# Altium schematic sheet rc_gen.SchDoc: rc-gen
size A4; DrawnBy: daniw; Organization: HSLU T&A; Address1: Abteilung Elektrotechnik; Address2: Technikumsstrasse 21; Address3: CH-6048 Horw; Revision: 1; SheetNumber: 1; SheetTotal: 1; Projektname: rc-gen
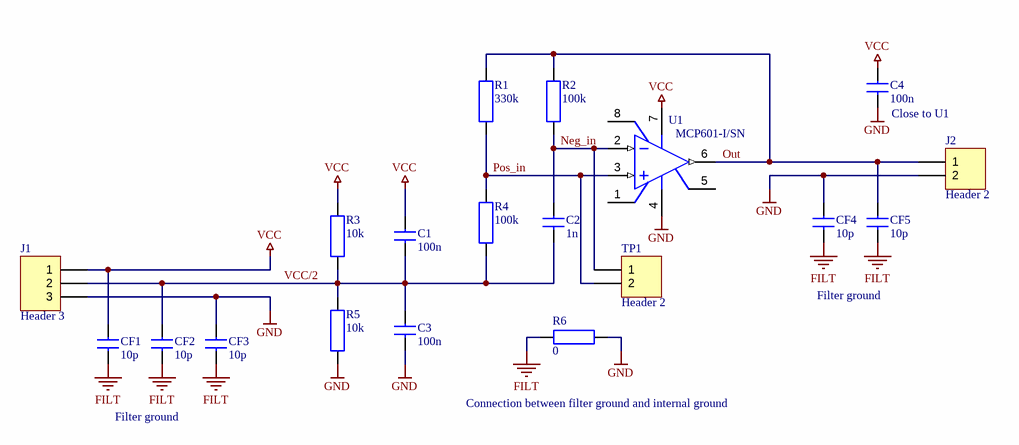
[diagram p0: rc_gen.SchDoc]

## Parts
C1  100n  [0805]
C2  1n  [0805]
C3  100n  [0805]
C4  100n  [0805]
CF1  10p  [0805]
CF2  10p  [0805]
CF3  10p  [0805]
CF4  10p  [0805]
CF5  10p  [0805]
J1  Header 3  [HDR1X3]
J2  Header 2  [HDR1X2]
R1  330k  [0805]
R2  100k  [0805]
R3  10k  [0805]
R4  100k  [0805]
R5  10k  [0805]
R6  0  [0805]
TP1  Header 2  [HDR1X2]
U1  MCP601-I/SN  [SOIC-SN8_N]

## Nets
FILT: CF1.2 CF2.2 CF3.2 CF4.2 CF5.2 R6.1
GND: C3.2 C4.2 CF3.1 CF4.1 J1.3 J2.2 R5.1 R6.2 U1.4(VSS)
VCC: C1.1 C4.1 CF1.1 J1.1 R3.2 U1.7(VDD)
Neg_in: C2.1 R2.1 TP1.1 U1.2(VIN-)
Out: CF5.1 J2.1 R1.2 R2.2 U1.6(VOUT)
Pos_in: R1.1 R4.2 TP1.2 U1.3(VIN+)
VCC/2: C1.2 C2.2 C3.1 CF2.1 J1.2 R3.1 R4.1 R5.2

Not connected (* = marked no-connect by the designer): U1 1(NC) 5(NC) 8(NC)

## Notes on the sheet
- (near C4) Close to U1
- Filter ground
- Connection between filter ground and internal ground
- Project:
- Drawn by:
- Size:
- Sheet
- A4
- Rev.:
- of
- Date:
- File:

## Library data of the parts
C1-C4 CF1-CF5 = C?: Normaler Kondensator
  C1-C4: ClassName: circuit
  CF1-CF5: ClassName: filtermass
J1 = Header 3: Header, 3-Pin; LatestRevisionDate: 17-Jul-2002; LatestRevisionNote: Re-released for DXP Platform.; Publisher: Altium Limited; ClassName: filtermass
J2 TP1 = Header 2: Header, 2-Pin; LatestRevisionDate: 17-Jul-2002; LatestRevisionNote: Re-released for DXP Platform.; Publisher: Altium Limited
  J2: ClassName: filtermass
  TP1: ClassName: circuit
R1-R6 = R?: Normaler Widerstand
  R1-R5: ClassName: circuit
  R6: ClassName: con_filt_circ
U1 = MCP601-I/SN: 2.7V to 6.0V Single Supply CMOS Operational Amplifier, 8-Pin SOIC, Industrial Temperature; Published: 29-Jan-2009; DatasheetVersion: revG, Dec-2007; PackageVersion: revBB, Aug-2009; PackageReference: SOIC-SN8; Publisher: Altium Limited; PackageDescription: 8-Lead Plastic Small Outline (SN) - Narrow, 3.90mm Body [SOIC]; Supplier 1: Digi-Key; Supplier Part Number 1: MCP601-I/SN-ND; Supplier 2: Farnell; Supplier Part Number 2: 9758623; Code_JEDEC: MS-012; Code_IPC: SOIC127P600-8; ComponentLink1Description: Datasheet; ComponentLink1URL: http://ww1.microchip.com/downloads/en/DeviceDoc/21314g.pdf; ComponentLink2Description: Packaging Specification; ComponentLink2URL: http://www.microchip.com/stellent/groups/techpub_sg/documents/packagingspec/en012702.pdf; ComponentLink3Description: Microchip.com Home; ComponentLink3URL: http://www.microchip.com/; ClassName: circuit